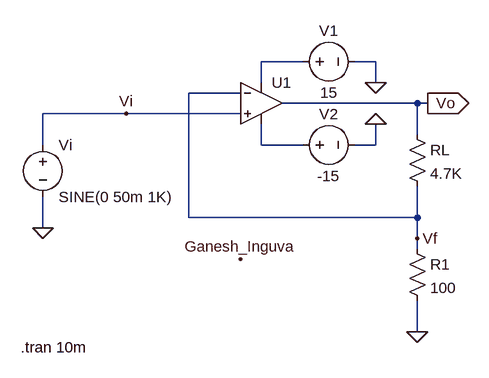
[diagram p0: schematic Run 3_C.asc]
Run 3_C.asc, the LTspice schematic file:
Version 4
SHEET 1 880 680
WIRE 272 16 208 16
WIRE 384 16 352 16
WIRE 208 48 208 16
WIRE 384 48 384 16
WIRE 176 64 96 64
WIRE 448 80 240 80
WIRE 464 80 448 80
WIRE 0 96 -128 96
WIRE 176 96 0 96
WIRE 448 128 448 80
WIRE -128 144 -128 96
WIRE 208 144 208 112
WIRE 272 144 208 144
WIRE 384 144 384 112
WIRE 384 144 352 144
WIRE 96 256 96 64
WIRE 448 256 448 208
WIRE 448 256 96 256
WIRE -128 272 -128 224
WIRE 448 288 448 256
WIRE 448 304 448 288
WIRE 448 432 448 384
FLAG 384 48 0
FLAG 384 112 0
FLAG 448 432 0
FLAG -128 272 0
FLAG 464 80 Vo
IOPIN 464 80 Out
FLAG 448 288 Vf
FLAG 0 96 Vi
FLAG 176 320 Ganesh_Inguva
SYMBOL OpAmps\\UniversalOpamp2 208 80 R0
SYMATTR InstName U1
SYMBOL voltage 256 16 R270
WINDOW 0 32 56 VTop 2
WINDOW 3 -32 56 VBottom 2
WINDOW 123 0 0 Left 0
WINDOW 39 0 0 Left 0
SYMATTR InstName V1
SYMATTR Value 15
SYMBOL voltage 256 144 R270
WINDOW 0 32 56 VTop 2
WINDOW 3 -32 56 VBottom 2
WINDOW 123 0 0 Left 0
WINDOW 39 0 0 Left 0
SYMATTR InstName V2
SYMATTR Value -15
SYMBOL res 432 112 R0
SYMATTR InstName RL
SYMATTR Value 4.7K
SYMBOL res 432 288 R0
SYMATTR InstName R1
SYMATTR Value 100
SYMBOL voltage -128 128 R0
WINDOW 123 0 0 Left 0
WINDOW 39 0 0 Left 0
SYMATTR InstName Vi
SYMATTR Value SINE(0 50m 1K)
TEXT -162 456 Left 2 !.tran 10m

The netlist it stands for:
* Run 3_C.asc
XU1 Vi Vf N001 N002 Vo level.2 Avol=1Meg GBW=10Meg Slew=10Meg ilimit=25m rail=0 Vos=0 phimargin=45 en=0 enk=0 in=0 ink=0 Rin=500Meg  ; pins IN+ IN- V+ V- OUT
V1 N001 0 15
V2 N002 0 -15
RL Vo Vf 4.7K
R1 Vf 0 100
Vi Vi 0 SINE(0 50m 1K)
.tran 10m
.lib UniversalOpamps2.sub
.backanno
.end